# Altium schematic sheet Bin_L_Box.SchDoc
size A
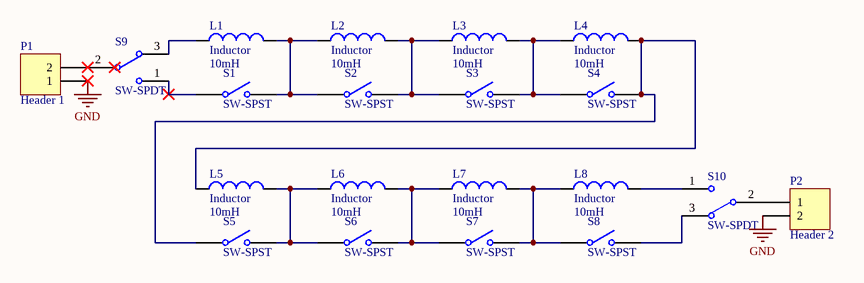
[diagram p0: Bin_L_Box.SchDoc]

## Parts
L1  Inductor  value 10mH  [T38 Toroidal Inductor]
L2  Inductor  value 10mH  [T38 Toroidal Inductor]
L3  Inductor  value 10mH  [T38 Toroidal Inductor]
L4  Inductor  value 10mH  [T38 Toroidal Inductor]
L5  Inductor  value 10mH  [T38 Toroidal Inductor]
L6  Inductor  value 10mH  [T38 Toroidal Inductor]
L7  Inductor  value 10mH  [T38 Toroidal Inductor]
L8  Inductor  value 10mH  [T38 Toroidal Inductor]
P1  Header 1  [HDR1X2]
P2  Header 2  [HDR1X2]
S1  SW-SPST  [SPST]
S2  SW-SPST  [SPST]
S3  SW-SPST  [SPST]
S4  SW-SPST  [SPST]
S5  SW-SPST  [SPST]
S6  SW-SPST  [SPST]
S7  SW-SPST  [SPST]
S8  SW-SPST  [SPST]
S9  SW-SPDT  [SPDT]
S10  SW-SPDT  [SPDT]

## Nets
GND: P1.1 P2.2
NetL1_1: L1.1 S9.3
NetL1_2: L1.2 L2.1 S1.2(NO) S2.1(COMMON)
NetL2_2: L2.2 L3.1 S2.2(NO) S3.1(COMMON)
NetL3_2: L3.2 L4.1 S3.2(NO) S4.1(COMMON)
NetL4_2: L4.2 L5.1 S4.2(NO) S5.1(COMMON)
NetL5_2: L5.2 L6.1 S5.2(NO) S6.1(COMMON)
NetL6_2: L6.2 L7.1 S6.2(NO) S7.1(COMMON)
NetL7_2: L7.2 L8.1 S7.2(NO) S8.1(COMMON)
NetL8_2: L8.2 S10.1
NetP1_2: P1.2 S9.2
NetP2_1: P2.1 S10.2
NetS1_1: S1.1(COMMON) S9.1
NetS8_2: S8.2(NO) S10.3

## Library data of the parts
L1-L8 = Inductor: Code_IEC: 1005; Published: 8-Jun-2000; LatestRevisionDate: 29-May-2009; LatestRevisionNote: IPC-7351 Footprint Added.; PackageReference: 0402-A; Publisher: Altium Limited; PackageDescription: Chip Inductor; Code_JEITA: 0402
P1 P2 = Header 2: Header, 2-Pin; LatestRevisionDate: 17-Jul-2002; LatestRevisionNote: Re-released for DXP Platform.; Publisher: Altium Limited
S1-S8 = SW-SPST: Single-Pole, Single-Throw Switch; Published: 24-Mar-1999; LatestRevisionDate: 17-Jul-2002; LatestRevisionNote: Re-released for DXP Platform.; PackageReference: SPST-2; Publisher: Altium Limited
S9 S10 = SW-SPDT: SPDT Subminiature Toggle Switch, Right Angle Mounting, Vertical Actuation; Published: 24-Mar-1999; LatestRevisionDate: 17-Dec-2003; LatestRevisionNote: Schematic revised, PCB Footprint replaced.; DatasheetVersion: 05-Dec-2000; PackageReference: TL36WW15050; Publisher: Altium Limited; ComponentLink1Description: Manufacturer Link; ComponentLink1URL: http://www.apem.com